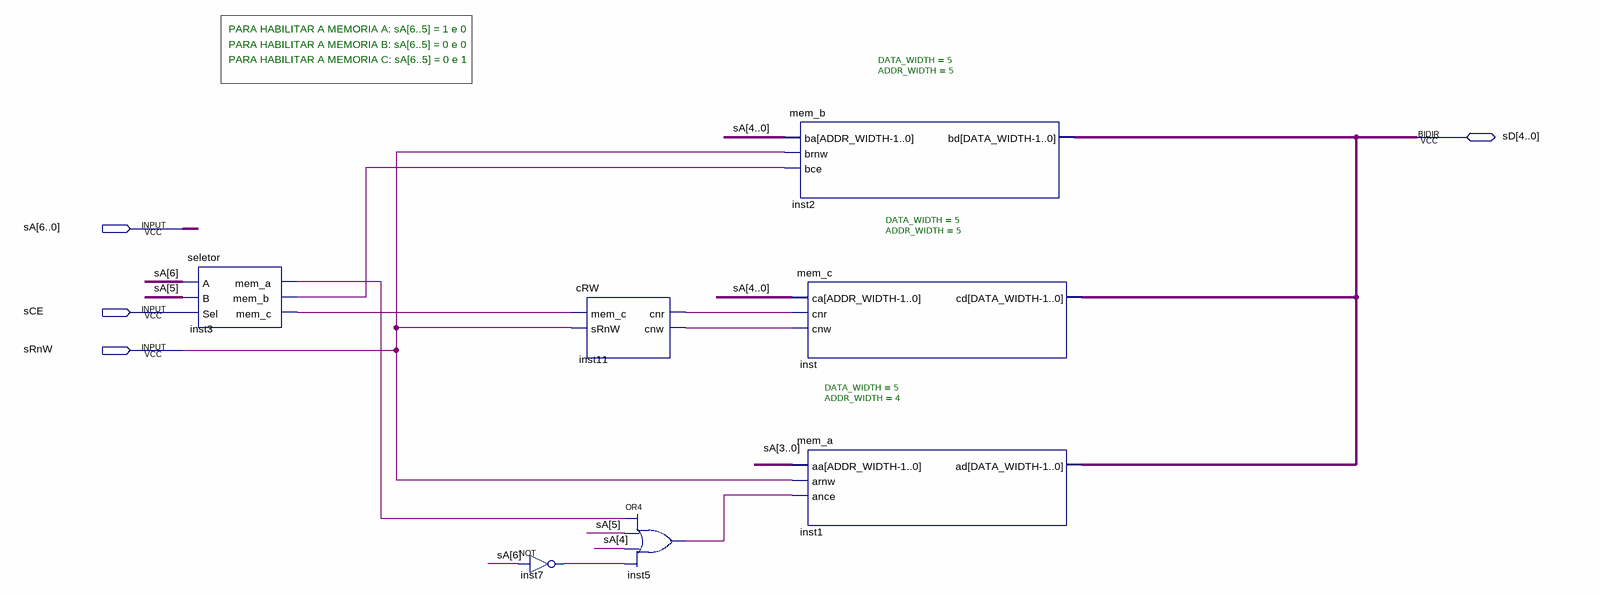
[diagram p0: schematic sheet]
// Quartus schematic mem_s.bdf as structural Verilog: 7 symbols, 4 pins
module mem_s (
  input  [6:0] sA,
  input  sCE,
  input  sRnW,
  inout  [4:0] sD
);

  wire inst3_mem_a, inst3_mem_b, inst3_mem_c, inst5_out, inst7_out, inst11_cnr, inst11_cnw;

  seletor inst3 (.A(sA[6]), .B(sA[5]), .Sel(sCE), .mem_a(inst3_mem_a), .mem_b(inst3_mem_b), .mem_c(inst3_mem_c));
  not inst7 (inst7_out, sA[6]);
  cRW inst11 (.mem_c(inst3_mem_c), .sRnW(sRnW), .cnr(inst11_cnr), .cnw(inst11_cnw));
  or inst5 (inst5_out, inst3_mem_a, sA[5], sA[4], inst7_out);
  mem_b #(.DATA_WIDTH(5), .ADDR_WIDTH(5)) inst2 (.ba(sA[4:0]), .brnw(sRnW), .bce(inst3_mem_b), .bd(sD));
  mem_c #(.DATA_WIDTH(5), .ADDR_WIDTH(5)) inst (.ca(sA[4:0]), .cnr(inst11_cnr), .cnw(inst11_cnw), .cd(sD));
  mem_a #(.DATA_WIDTH(5), .ADDR_WIDTH(4)) inst1 (.aa(sA[3:0]), .arnw(sRnW), .ance(inst5_out), .ad(sD));

  // Notes on the sheet:
  //   PARA HABILITAR A MEMORIA A: sA[6..5] = 1 e 0
  //   PARA HABILITAR A MEMORIA B: sA[6..5] = 0 e 0
  //   PARA HABILITAR A MEMORIA C: sA[6..5] = 0 e 1
endmodule
